# Altium schematic sheet COVER PAGE.SchDoc
size A4; SheetNumber: 2; SheetTotal: 2
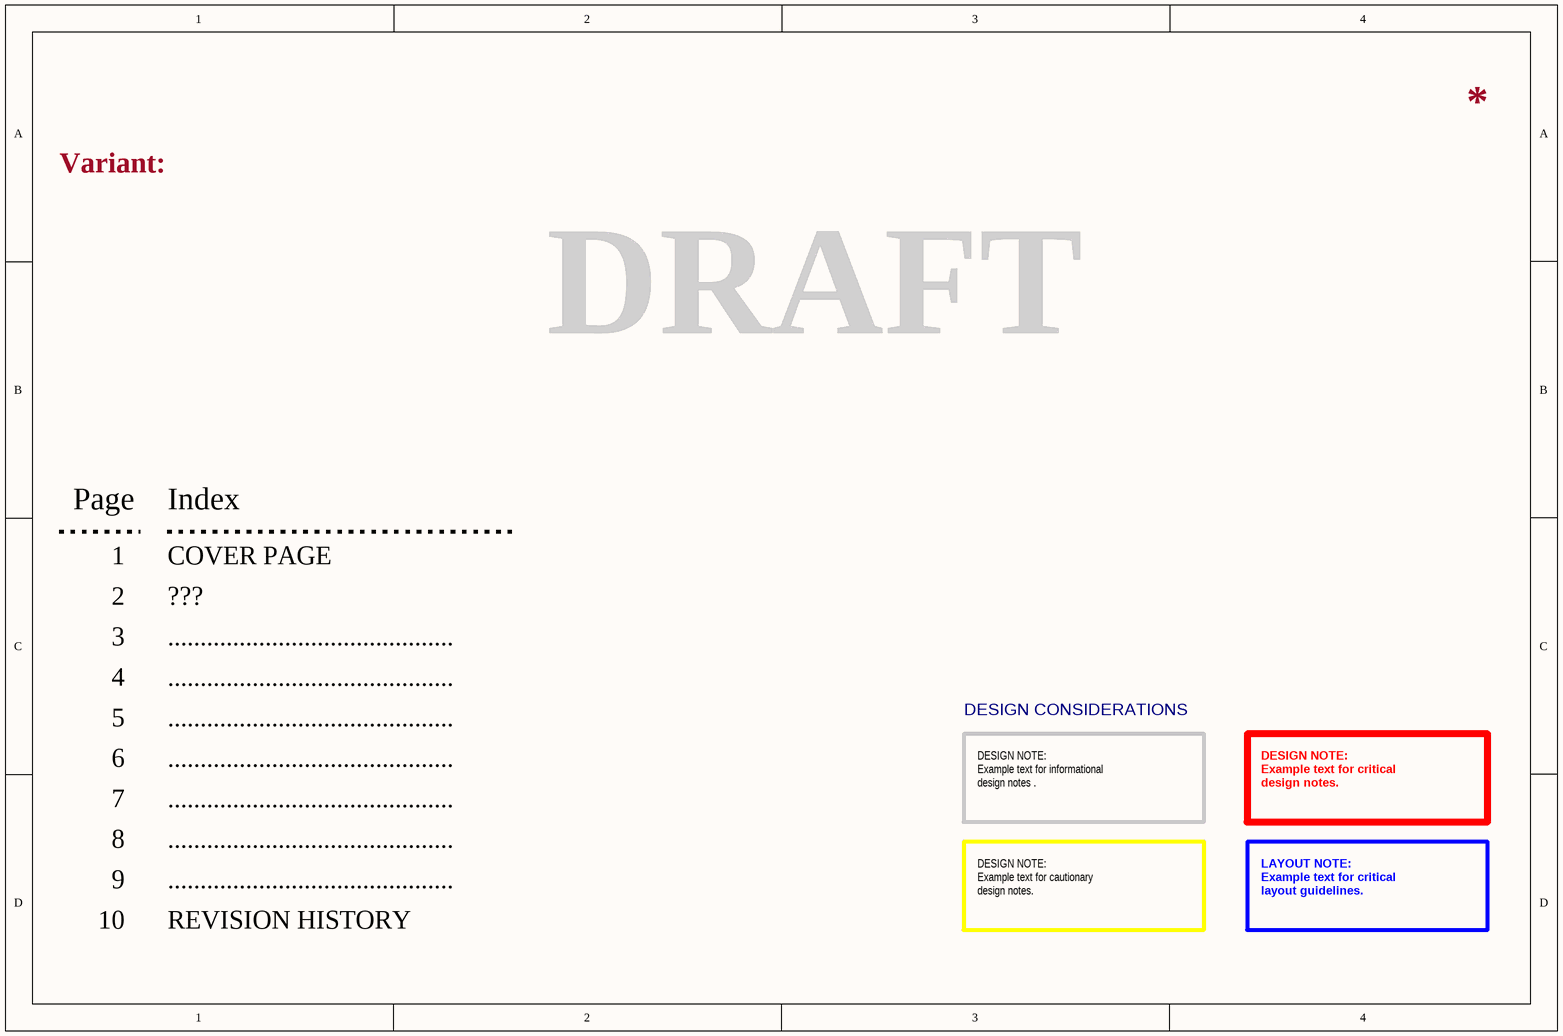
[diagram p0: COVER PAGE.SchDoc]

## Notes on the sheet
- Variant:
- DRAFT
- Page
- Index
- 1
- COVER PAGE
- 2
- 3
- ???
- ............................................
- 4
- DESIGN CONSIDERATIONS
- 5
- 6
- 7
- 8
- DESIGN NOTE:
  Example text for informational
  design notes .
- DESIGN NOTE:
  Example text for critical
  design notes.
- 9
- DESIGN NOTE:
  Example text for cautionary
  design notes.
- LAYOUT NOTE:
  Example text for critical
  layout guidelines.
- 10
- REVISION HISTORY